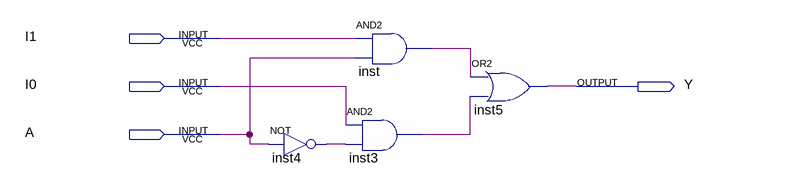
[diagram p0: schematic sheet]
// Quartus schematic Mux21.bdf as structural Verilog: 4 symbols, 4 pins
module Mux21 (
  input  I1,
  input  I0,
  input  A,
  output Y
);

  wire inst3_out, inst4_out, inst_out;

  not inst4 (inst4_out, A);
  and inst (inst_out, I1, A);
  and inst3 (inst3_out, I0, inst4_out);
  or inst5 (Y, inst_out, inst3_out);
endmodule
